# EAGLE schematic DualBalancedInput (EAGLE 7.5.0)
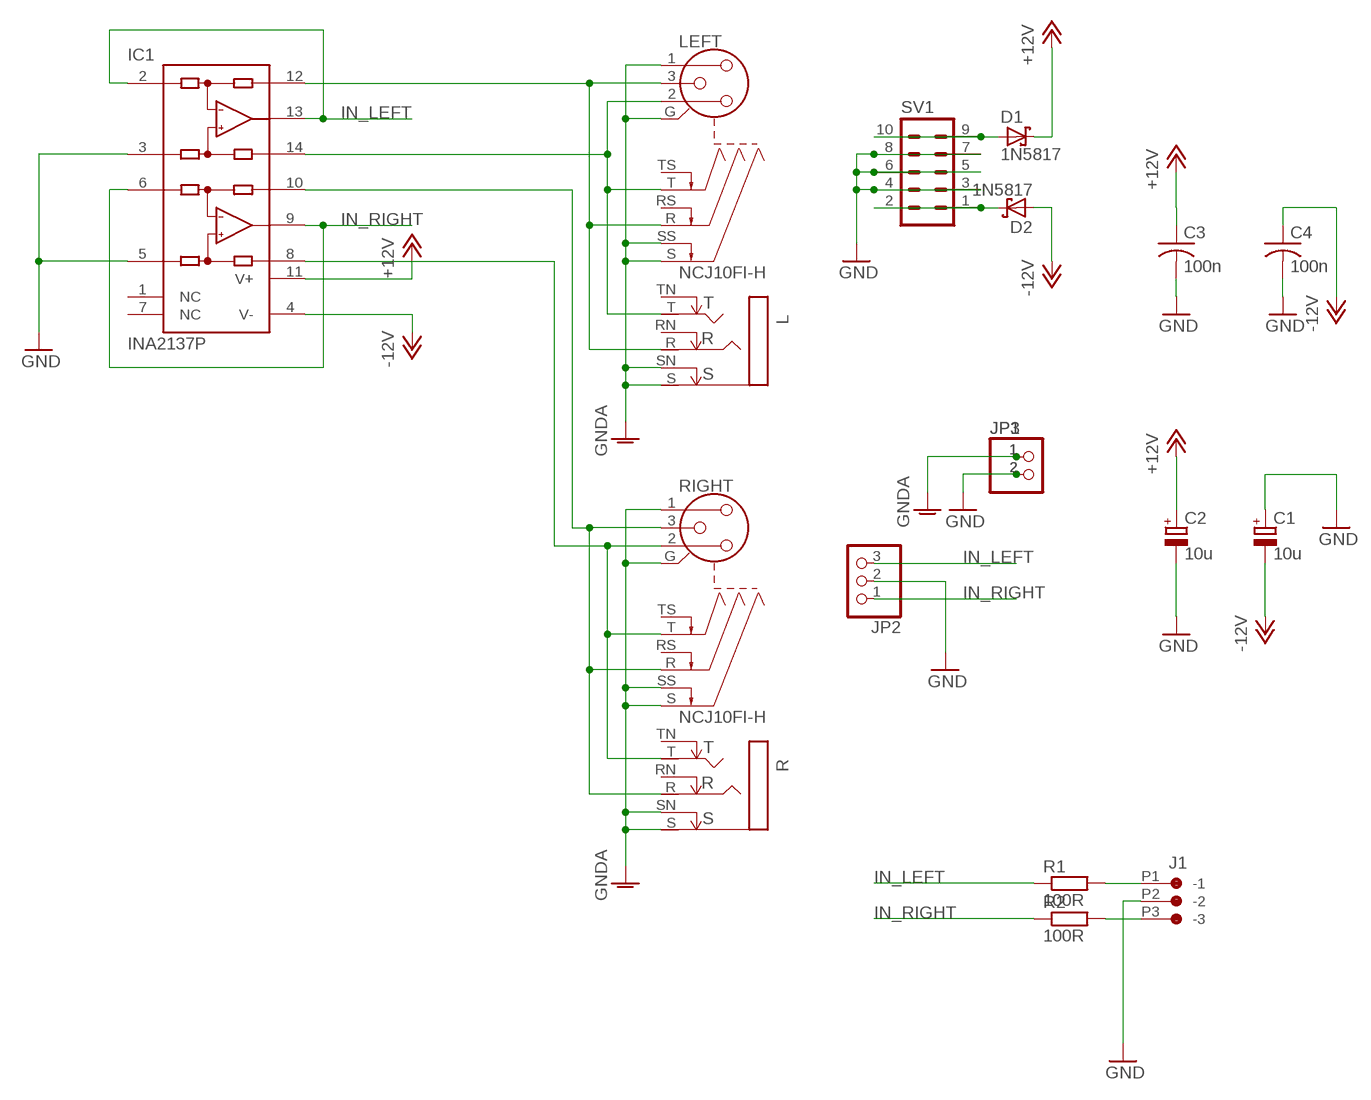
[diagram p0: schematic, sheet 1]

## Parts
C1  10u  CPOL-EUE5-6  [E5-6]
C2  10u  CPOL-EUE5-6  [E5-6]
C3  100n  C-US050-024X044  [C050-024X044]
C4  100n  C-US050-024X044  [C050-024X044]
D1  1N5817  1N5819-B  [DO41-7.6]
D2  1N5817  1N5819-B  [DO41-7.6]
IC1  INA2137P  [DIL14]
J1  CON-JST_PH_3W  [CON-JST_PH_3W]
JP1  PINHD-1X2  [1X02]
JP2  PINHD-1X3  [1X03]
JP3  PINHD-1X2  [1X02]
L  NEUTRIK_NMJ6HCD2  [NMJ6HCD2]
LEFT  NCJ10FI-H  [NCJ10FI-H]
R  NEUTRIK_NMJ6HCD2  [NMJ6HCD2]
R1  100R  R-EU_0204/7  [0204/7]
R2  100R  R-EU_0204/7  [0204/7]
RIGHT  NCJ10FI-H  [NCJ10FI-H]
SV1  MA05-2  [MA05-2]

## Nets
+12V: C2.+ C3.1 D1.C IC1.11(V+)
-12V: C1.- C4.1 D2.A IC1.4(V-)
GND: C1.+ C2.- C3.2 C4.2 IC1.3(+INA) IC1.5(+INB) J1.P2(-2) JP1.2 JP2.2 JP3.2 SV1.3 SV1.4 SV1.5 SV1.6 SV1.7 SV1.8
GNDA: JP1.1 JP3.1 L.S L.SN LEFT.1 LEFT.G LEFT.S LEFT.SS R.S R.SN RIGHT.1 RIGHT.G RIGHT.S RIGHT.SS
IN_LEFT: IC1.2(-INA) IC1.13(OUTA) JP2.3 R1.1
IN_RIGHT: IC1.6(-INB) IC1.9(OUTB) JP2.1 R2.1
N$1: IC1.14(REFA) L.T LEFT.2 LEFT.T
N$2: IC1.12(SENSEA) L.R LEFT.3 LEFT.R
N$5: D2.C SV1.1 SV1.2
N$6: D1.A SV1.9 SV1.10
N$7: J1.P3(-3) R2.2
N$9: J1.P1(-1) R1.2
N$18: IC1.8(REFB) R.T RIGHT.2 RIGHT.T
N$19: IC1.10(SENSEB) R.R RIGHT.3 RIGHT.R
Unconnected: IC1.1(NC) IC1.7(NC) L.RN L.TN LEFT.RS LEFT.TS R.RN R.TN RIGHT.RS RIGHT.TS

## Library data of the parts
C1 C2 = rcl:CPOL-EU: POLARIZED CAPACITOR, European symbol
C3 C4 = rcl:C-US: CAPACITOR, American symbol
D1 D2 = diode:1N581*: 1.0A SCHOTTKY BARRIER RECTIFIER Source: http://www.diodes.com/datasheets/ds23001.pdf
IC1 = burr-brown:INA2137: Audio Differential Line Receivers +-6dB, G=1/2 or 2; MF: TEXAS INSTRUMENT CONNECTORS; MPN: INA2137PA; OC_FARNELL: unknown; OC_NEWARK: 18M9116
J1 = Rebel:CON-JST_PH_3W
JP1 JP3 = pinhead:PINHD-1X2: PIN HEADER
JP2 = pinhead:PINHD-1X3: PIN HEADER
L R = neutrik_jacks:NEUTRIK_NMJ6HCD2
LEFT RIGHT = con-neutrik_ag:NCJ10FI-: Neutrik Audio Connector XLR SERIES Stereo 1/4" jack with switch Source: www.neutrik.com/; OC_FARNELL: unknown; OC_NEWARK: unknown
R1 R2 = Rebel:R-EU_: RESISTOR, European symbol
SV1 = con-lstb:MA05-2: PIN HEADER; OC_FARNELL: unknown; OC_NEWARK: unknown